# EAGLE board Jupiter Ace build026 (EAGLE 9.6.2), part 1 of 3
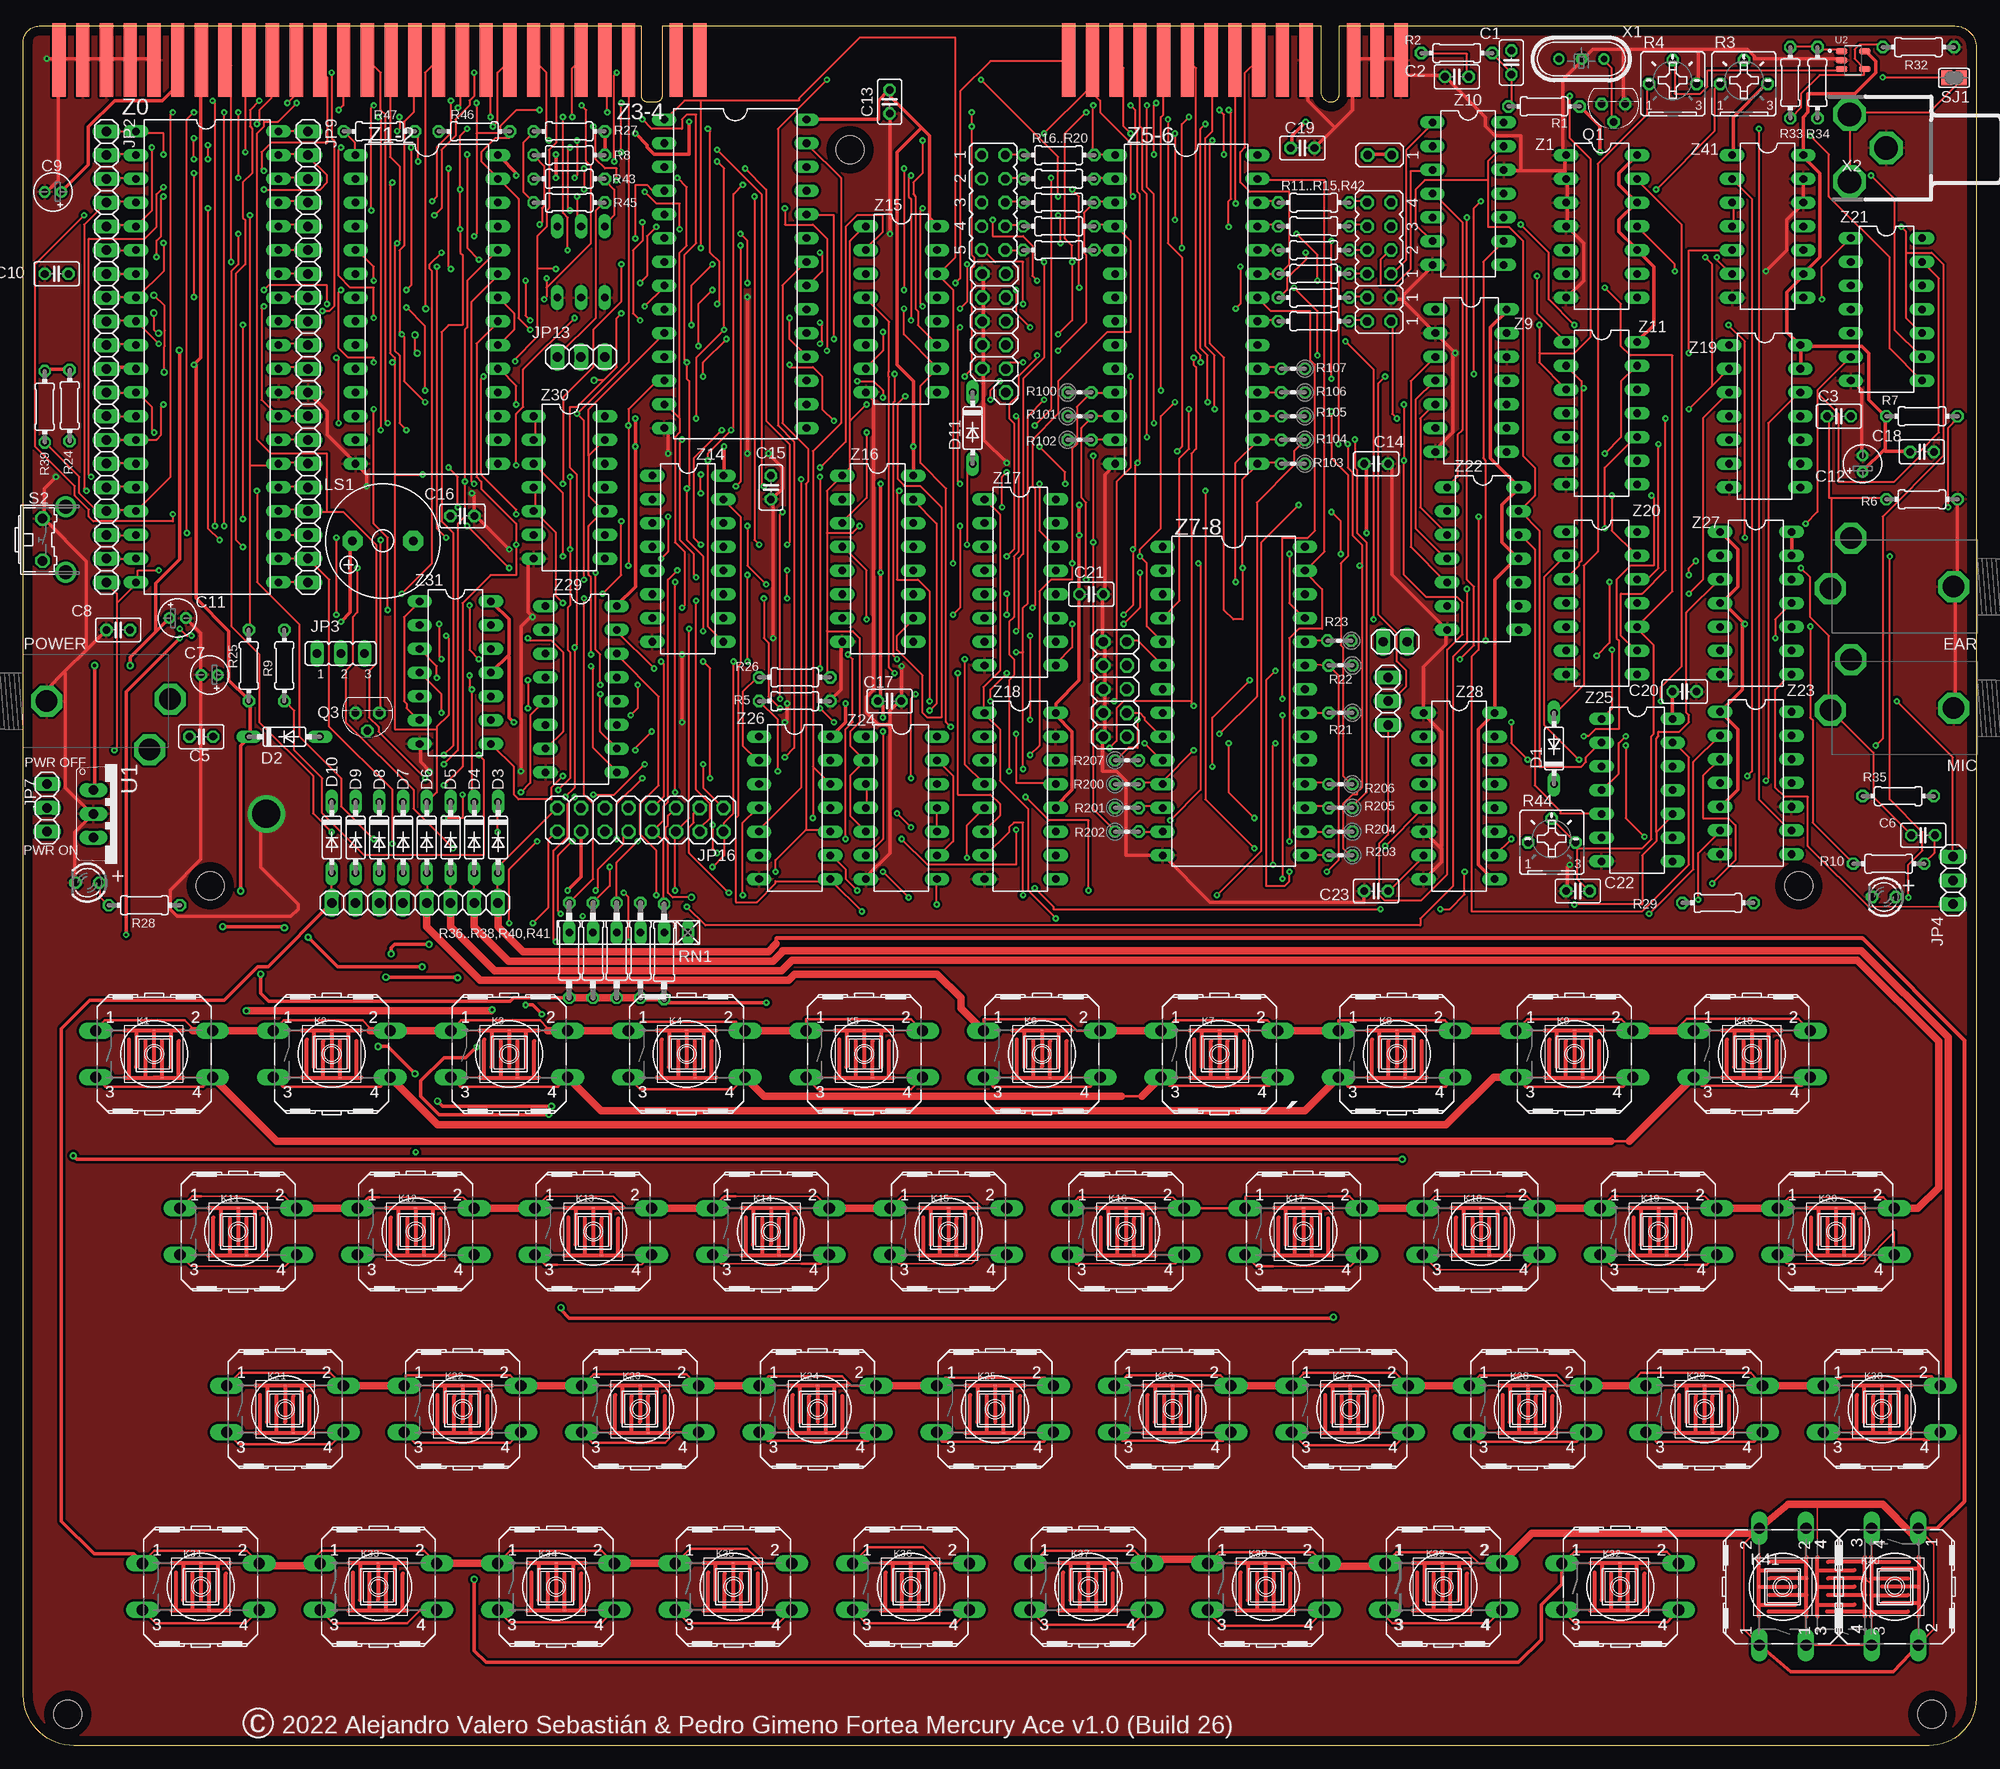
[diagram p5: board, top side]
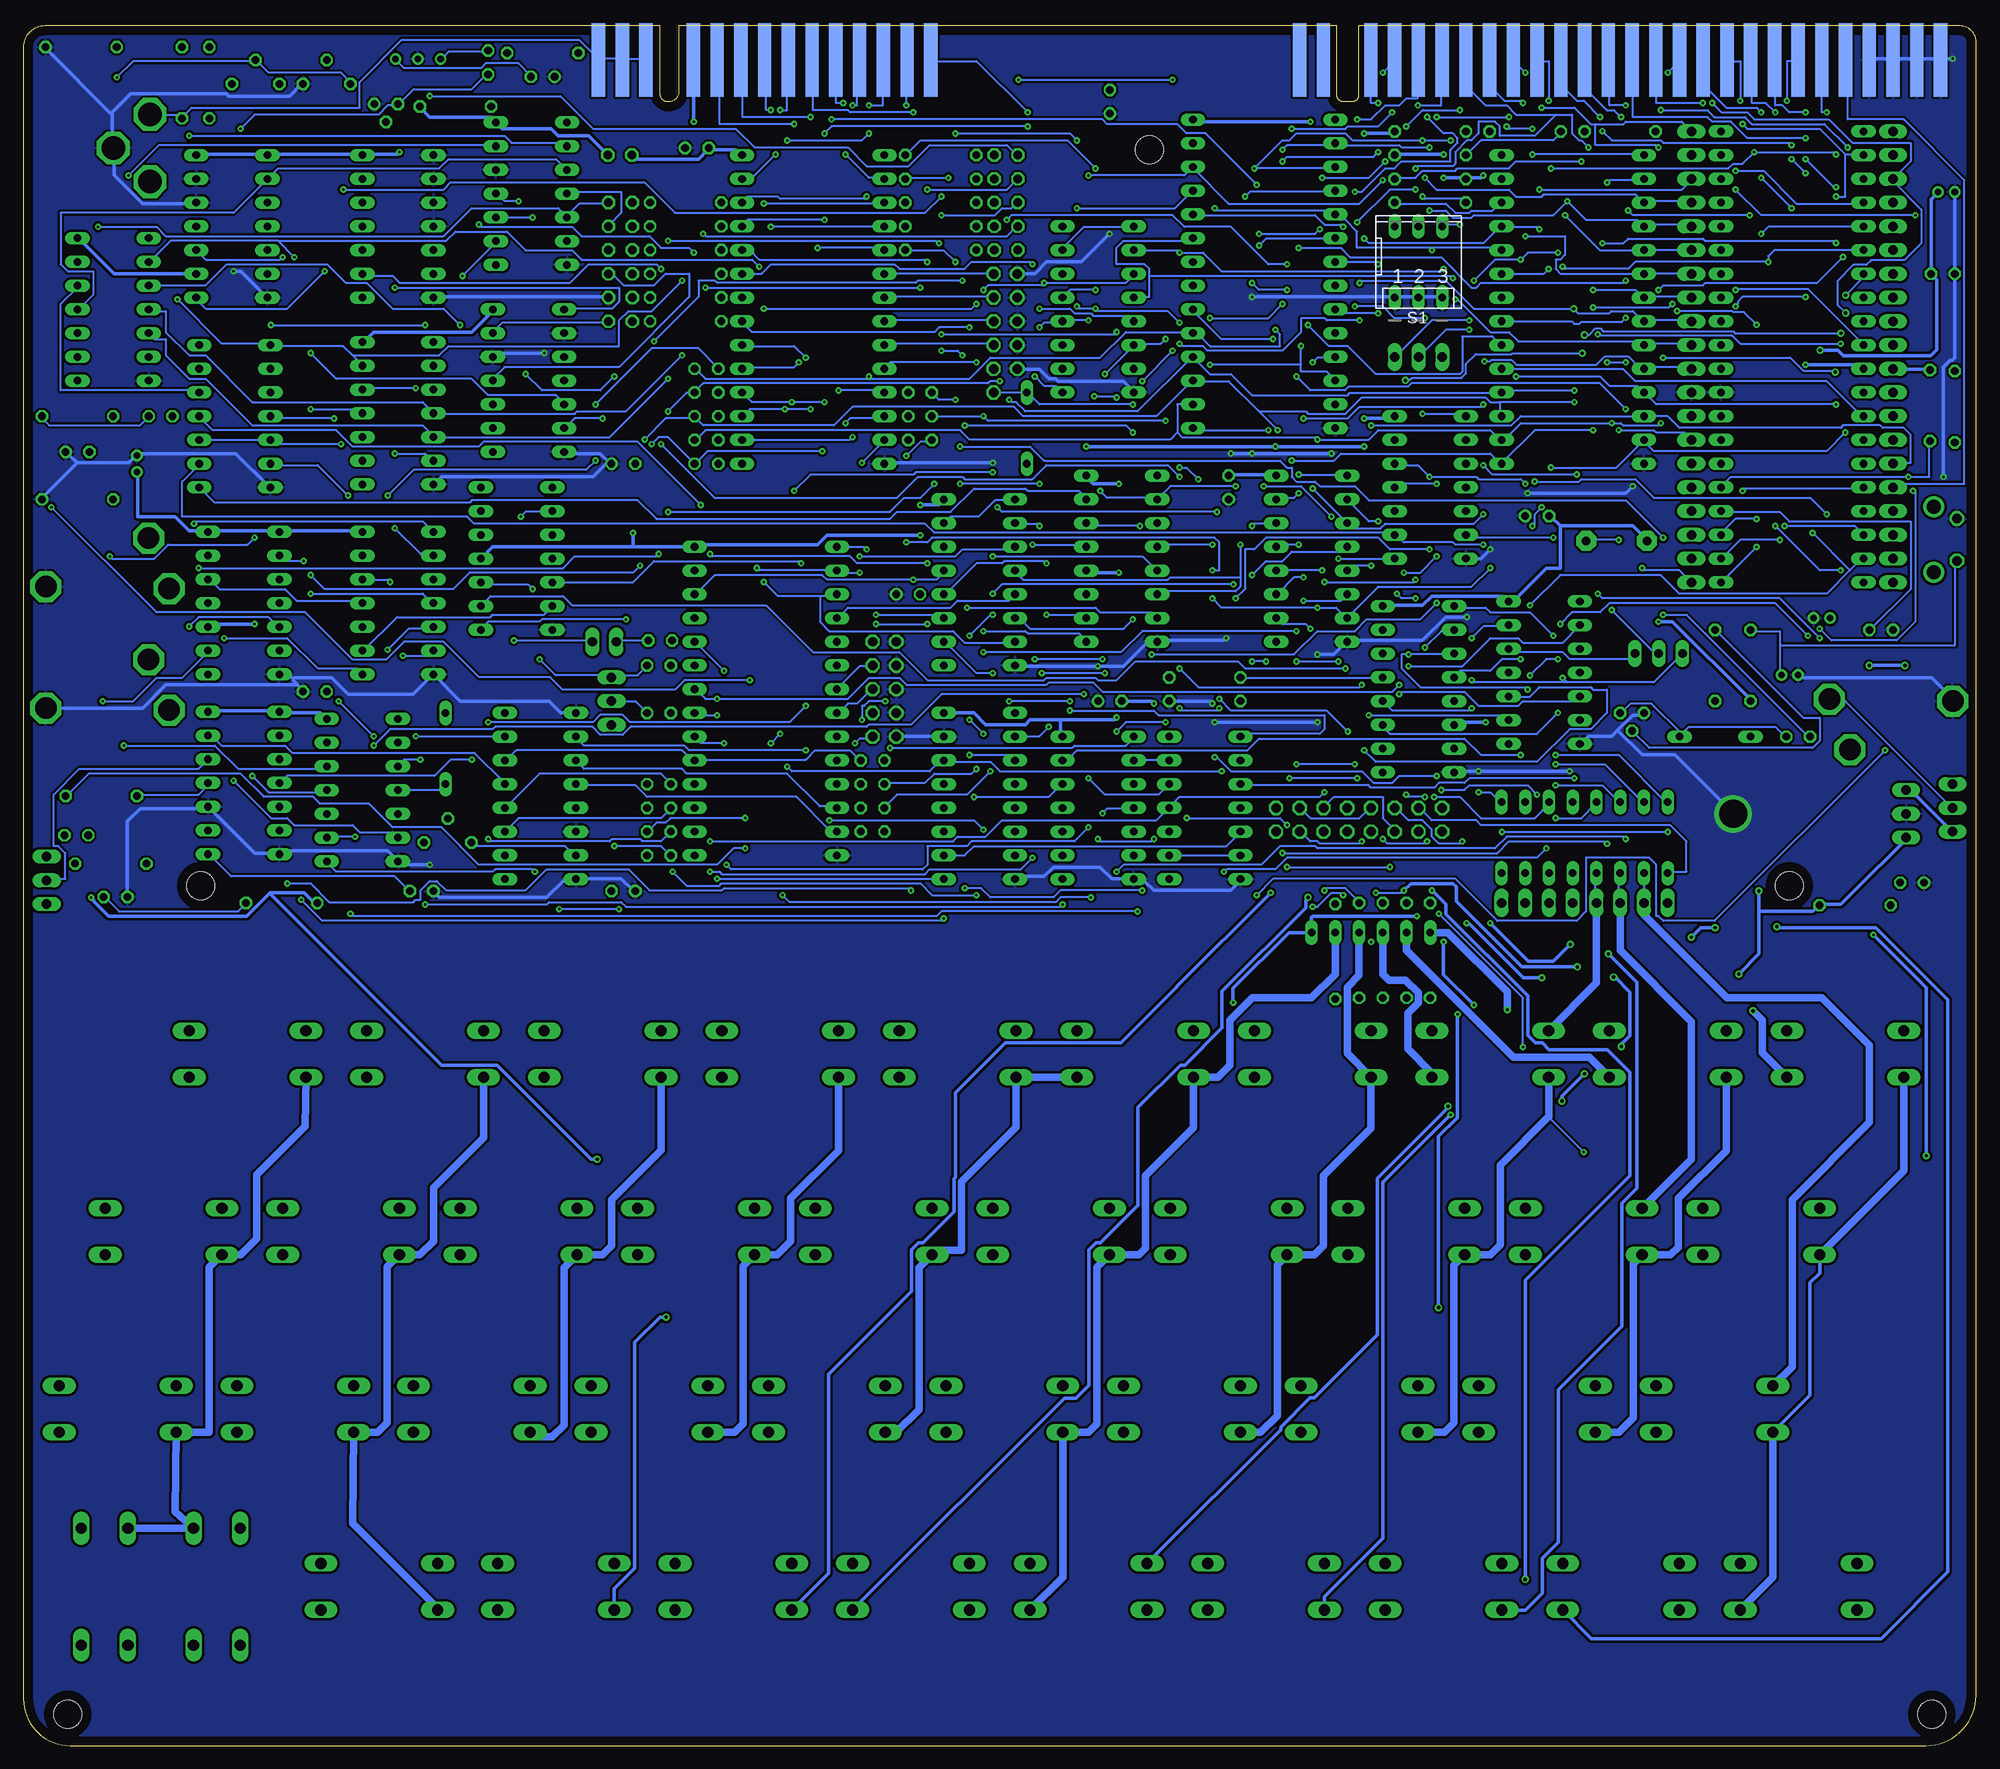
[diagram p6: board, bottom side, seen from below]

Size 209 x 184 mm. Coordinates in mm from the lower left corner, seen from the top.
Outline: 0,5.39 0,182.31 arc-90 1.69,184 66.1,184 66.1,176.56 arc90 66.77,175.9 67.77,175.9 arc90 68.4,176.53 68.4,184 138.86,184 138.86,176.98 arc90 139.96,175.87 arc90 140.86,176.77 140.86,184 206.72,184 arc-90 209,181.72 209,5.01 arc-90 203.99,0 5.39,0 arc-90 0,5.39
Copper layers (1*16): Top 0.035mm / dielectric 1.5mm / Bottom 0.035mm
Design rules "default *": minimum track width 6mil, minimum drill 10mil, track to track 8mil, track to pad 8mil, pad to pad 8mil, via to via 8mil, smd to smd 8mil, copper to edge 40mil, drill to drill 8mil, minimum pad ring 10mil, minimum via ring 8mil, stop-mask expansion 4mil, vias tented up to drill 0mil, thermal gap 10mil
Net classes: 0 default: width 0.2 mm; 1 power: width 0.4 mm
Holes 3 mm at 20,92 190,92 88.5,170.75 4.76,3.37 204.24,3.37
bKeepout: 1 lines
tRestrict: 1 lines
bRestrict: 1 lines
vRestrict: area 14,91.4 to 29.2,101.6

## Footprints (pad centres in the part's own frame; a part is rotated, then mirrored left to right if it is on the bottom)
EDGEPIN = smd 1.422 x 7.874: 1 0,0
C025-025X050 = drill 0.813 octagon: 1 -1.27,0; 2 1.27,0
E1,8-4 = drill 0.711 pad 1.168: + -0.889,0 | drill 0.711 pad 1.168 octagon: - 0.889,0
DO35-7 = drill 0.813 long: A 3.81,0; C -3.81,0
PJ302M = drill 2.3 pad 3.3 octagon: GND 2.5,0; SW 13.5,-5.2; TIP 15.7,0.2
1X08 = drill 1.016 long: 1 -8.89,0; 2 -6.35,0; 3 -3.81,0; 4 -1.27,0; 5 1.27,0; 6 3.81,0; 7 6.35,0; 8 8.89,0
1X20 = drill 1.016 long: 1 -24.13,0; 2 -21.59,0; 3 -19.05,0; 4 -16.51,0; 5 -13.97,0; 6 -11.43,0; 7 -8.89,0; 8 -6.35,0; 9 -3.81,0; 10 -1.27,0; 11 1.27,0; 12 3.81,0; 13 6.35,0; 14 8.89,0; 15 11.43,0; 16 13.97,0; 17 16.51,0; 18 19.05,0; 19 21.59,0; 20 24.13,0
JP2 = drill 0.914 long: 1 -2.54,0; 2 0,0; 3 2.54,0
1X03 = drill 1.016 long: 1 -2.54,0; 2 0,0; 3 2.54,0
JP1Q = drill 0.914 octagon: 1 -1.27,-1.27; 2 -1.27,1.27
JP4Q = drill 0.914 octagon: 1 -3.81,-1.27; 2 -3.81,1.27; 3 -1.27,-1.27; 4 -1.27,1.27; 5 1.27,-1.27; 6 1.27,1.27; 7 3.81,-1.27; 8 3.81,1.27
2X05 = drill 1.016 octagon: 1 -5.08,-1.27; 2 -5.08,1.27; 3 -2.54,-1.27; 4 -2.54,1.27; 5 0,-1.27; 6 0,1.27; 7 2.54,-1.27; 8 2.54,1.27; 9 5.08,-1.27; 10 5.08,1.27
1X01 = drill 1.016 octagon: 1 0,0
JP5Q = drill 0.914 octagon: 1 -5.08,-1.27; 2 -5.08,1.27; 3 -2.54,-1.27; 4 -2.54,1.27; 5 0,-1.27; 6 0,1.27; 7 2.54,-1.27; 8 2.54,1.27; 9 5.08,-1.27; 10 5.08,1.27
2X08 = drill 1.016 octagon: 1 -8.89,-1.27; 2 -8.89,1.27; 3 -6.35,-1.27; 4 -6.35,1.27; 5 -3.81,-1.27; 6 -3.81,1.27; 7 -1.27,-1.27; 8 -1.27,1.27; 9 1.27,-1.27; 10 1.27,1.27; 11 3.81,-1.27; 12 3.81,1.27; 13 6.35,-1.27; 14 6.35,1.27; 15 8.89,-1.27; 16 8.89,1.27
1X02 = drill 1.016 long: 1 -1.27,0; 2 1.27,0
B3F-40XXNOHOLE = drill 1.194 long: 1 -6.248,2.489; 2 6.248,2.489; 3 -6.248,-2.489; 4 6.248,-2.489
LED3MM = drill 0.813 octagon: A -1.27,0; K 1.27,0
F/QMX = drill 0.914 pad 2.159 octagon: + 3.251,0; - -3.251,0
TO92 = drill 0.813 octagon: 1 1.27,0; 2 0,1.905; 3 -1.27,0
0204/7 = drill 0.813 octagon: 1 -3.81,0; 2 3.81,0
B25P = drill 0.813 octagon: A -2.54,0; E 2.54,0; S 0,2.54
0204V = drill 0.813 octagon: 1 -1.27,0; 2 1.27,0
0207/10 = drill 0.813 octagon: 1 -5.08,0; 2 5.08,0
RN-6 = drill 0.813 long: 1 -6.35,0; 2 -3.81,0; 3 -1.27,0; 4 1.27,0; 5 3.81,0; 6 6.35,0
DP-03 = drill 0.813 long: 1 -2.54,-3.81; 2 0,-3.81; 3 2.54,-3.81; 4 2.54,3.81; 5 0,3.81; 6 -2.54,3.81
B3F-31XX = drill 1.016 octagon: 1 -2.261,-1.245; 2 2.261,-1.245 | drill 1.499 pad 2.159: 3 -3.505,1.245; 4 3.505,1.245
SJ = smd 1.168 x 1.6: 1 -0.762,0; 2 0.762,0
TO220V = drill 1.016 long: 1 -2.54,-2.54; 2 0,-2.54; 3 2.54,-2.54
SOT95P280X145-5N = smd 1.22 x 0.6: 1 -1.245,0.95; 2 -1.245,0; 3 -1.245,-0.95; 4 1.245,-0.95; 5 1.245,0.95
CARBONB3F = smd 0.305 x 0.152: P$1 0,2.54; P$2 0.889,-2.54
HC49U = drill 0.7 pad 1.2: 1 -2.413,0; 2 -0.027,0; 3 2.413,0
CON-CONRAD_736880-49 = drill 2.5 pad 3.302 octagon: 1 -0.11,0; 2 3.81,3.595; 2@2 3.81,-3.595
DIL40 = drill 0.813 long: 1 -24.13,-7.62; 2 -21.59,-7.62; 3 -19.05,-7.62; 4 -16.51,-7.62; 5 -13.97,-7.62; 6 -11.43,-7.62; 7 -8.89,-7.62; 8 -6.35,-7.62; 9 -3.81,-7.62; 10 -1.27,-7.62; 11 1.27,-7.62; 12 3.81,-7.62; 13 6.35,-7.62; 14 8.89,-7.62; 15 11.43,-7.62; 16 13.97,-7.62; 17 16.51,-7.62; 18 19.05,-7.62; 19 21.59,-7.62; 20 24.13,-7.62; 21 24.13,7.62; 22 21.59,7.62; 23 19.05,7.62; 24 16.51,7.62; 25 13.97,7.62; 26 11.43,7.62; 27 8.89,7.62; 28 6.35,7.62; 29 3.81,7.62; 30 1.27,7.62; 31 -1.27,7.62; 32 -3.81,7.62; 33 -6.35,7.62; 34 -8.89,7.62; 35 -11.43,7.62; 36 -13.97,7.62; 37 -16.51,7.62; 38 -19.05,7.62; 39 -21.59,7.62; 40 -24.13,7.62
DIL14 = drill 0.813 long: 1 -7.62,-3.81; 2 -5.08,-3.81; 3 -2.54,-3.81; 4 0,-3.81; 5 2.54,-3.81; 6 5.08,-3.81; 7 7.62,-3.81; 8 7.62,3.81; 9 5.08,3.81; 10 2.54,3.81; 11 0,3.81; 12 -2.54,3.81; 13 -5.08,3.81; 14 -7.62,3.81
DIL28-6 = drill 0.813 long: 1 -16.51,-7.62; 2 -13.97,-7.62; 3 -11.43,-7.62; 4 -8.89,-7.62; 5 -6.35,-7.62; 6 -3.81,-7.62; 7 -1.27,-7.62; 8 1.27,-7.62; 9 3.81,-7.62; 10 6.35,-7.62; 11 8.89,-7.62; 12 11.43,-7.62; 13 13.97,-7.62; 14 16.51,-7.62; 15 16.51,7.62; 16 13.97,7.62; 17 11.43,7.62; 18 8.89,7.62; 19 6.35,7.62; 20 3.81,7.62; 21 1.27,7.62; 22 -1.27,7.62; 23 -3.81,7.62; 24 -6.35,7.62; 25 -8.89,7.62; 26 -11.43,7.62; 27 -13.97,7.62; 28 -16.51,7.62
DIL16 = drill 0.813 long: 1 -8.89,-3.81; 2 -6.35,-3.81; 3 -3.81,-3.81; 4 -1.27,-3.81; 5 1.27,-3.81; 6 3.81,-3.81; 7 6.35,-3.81; 8 8.89,-3.81; 9 8.89,3.81; 10 6.35,3.81; 11 3.81,3.81; 12 1.27,3.81; 13 -1.27,3.81; 14 -3.81,3.81; 15 -6.35,3.81; 16 -8.89,3.81

## Placement (x,y rotation side)
1A  [EDGEPIN]  11.43,180.34 0 top
1A1  [EDGEPIN]  111.89,180.34 0 top
1B  [EDGEPIN]  11.43,180.34 0 bottom
1B1  [EDGEPIN]  111.89,180.34 0 bottom
2A  [EDGEPIN]  13.97,180.34 0 top
2A1  [EDGEPIN]  114.43,180.34 0 top
2B  [EDGEPIN]  13.97,180.34 0 bottom
2B1  [EDGEPIN]  114.43,180.34 0 bottom
3A  [EDGEPIN]  16.51,180.34 0 top
3A1  [EDGEPIN]  116.97,180.34 0 top
3B  [EDGEPIN]  16.51,180.34 0 bottom
3B1  [EDGEPIN]  116.97,180.34 0 bottom
4A  [EDGEPIN]  19.05,180.34 0 top
4A1  [EDGEPIN]  119.51,180.34 0 top
4B  [EDGEPIN]  19.05,180.34 0 bottom
4B2  [EDGEPIN]  119.51,180.34 0 bottom
5A  [EDGEPIN]  21.59,180.34 0 top
5A1  [EDGEPIN]  122.05,180.34 0 top
5B  [EDGEPIN]  21.59,180.34 0 bottom
5B2  [EDGEPIN]  122.05,180.34 0 bottom
6A  [EDGEPIN]  24.13,180.34 0 top
6A1  [EDGEPIN]  124.59,180.34 0 top
6B  [EDGEPIN]  24.13,180.34 0 bottom
6B2  [EDGEPIN]  124.59,180.34 0 bottom
7A  [EDGEPIN]  26.67,180.34 0 top
7A1  [EDGEPIN]  127.13,180.34 0 top
7B  [EDGEPIN]  26.67,180.34 0 bottom
7B2  [EDGEPIN]  127.13,180.34 0 bottom
8A  [EDGEPIN]  29.21,180.34 0 top
8A1  [EDGEPIN]  129.67,180.34 0 top
8B  [EDGEPIN]  29.21,180.34 0 bottom
8B2  [EDGEPIN]  129.67,180.34 0 bottom
9A  [EDGEPIN]  31.75,180.34 0 top
9A1  [EDGEPIN]  132.21,180.34 0 top
9B  [EDGEPIN]  31.75,180.34 0 bottom
9B1  [EDGEPIN]  132.21,180.34 0 bottom
10A  [EDGEPIN]  34.29,180.34 0 top
10A1  [EDGEPIN]  134.75,180.34 0 top
10B  [EDGEPIN]  34.29,180.34 0 bottom
10B1  [EDGEPIN]  134.75,180.34 0 bottom
11A  [EDGEPIN]  36.83,180.34 0 top
11A1  [EDGEPIN]  137.29,180.34 0 top
11B  [EDGEPIN]  36.83,180.34 0 bottom
11B1  [EDGEPIN]  137.29,180.34 0 bottom
12A  [EDGEPIN]  39.37,180.34 0 top
12B  [EDGEPIN]  39.37,180.34 0 bottom
13A  [EDGEPIN]  41.91,180.34 0 top
13A1  [EDGEPIN]  142.37,180.34 0 top
13B  [EDGEPIN]  41.91,180.34 0 bottom
13B1  [EDGEPIN]  142.37,180.34 0 bottom
14A  [EDGEPIN]  44.45,180.34 0 top
14A1  [EDGEPIN]  144.91,180.34 0 top
14B  [EDGEPIN]  44.45,180.34 0 bottom
14B1  [EDGEPIN]  144.91,180.34 0 bottom
15A  [EDGEPIN]  46.99,180.34 0 top
15A1  [EDGEPIN]  147.45,180.34 0 top
15B  [EDGEPIN]  46.99,180.34 0 bottom
15B1  [EDGEPIN]  147.45,180.34 0 bottom
16A  [EDGEPIN]  49.53,180.34 0 top
16B  [EDGEPIN]  49.53,180.34 0 bottom
17A  [EDGEPIN]  52.07,180.34 0 top
17B  [EDGEPIN]  52.07,180.34 0 bottom
18A  [EDGEPIN]  54.61,180.34 0 top
18B  [EDGEPIN]  54.61,180.34 0 bottom
19A  [EDGEPIN]  57.15,180.34 0 top
19B  [EDGEPIN]  57.15,180.34 0 bottom
20A  [EDGEPIN]  59.69,180.34 0 top
20B  [EDGEPIN]  59.69,180.34 0 bottom
21A  [EDGEPIN]  62.23,180.34 0 top
21B  [EDGEPIN]  62.23,180.34 0 bottom
22A  [EDGEPIN]  64.77,180.34 0 top
22B  [EDGEPIN]  64.77,180.34 0 bottom
24A  [EDGEPIN]  69.85,180.34 0 top
24B  [EDGEPIN]  69.85,180.34 0 bottom
25A  [EDGEPIN]  72.39,180.34 0 top
25B  [EDGEPIN]  72.39,180.34 0 bottom
26A  [EDGEPIN]  8.89,180.34 0 top
26B  [EDGEPIN]  8.89,180.34 0 bottom
27A  [EDGEPIN]  6.35,180.34 0 top
27B  [EDGEPIN]  6.35,180.34 0 bottom
28A  [EDGEPIN]  3.81,180.34 0 top
28B  [EDGEPIN]  3.81,180.34 0 bottom
C1  30pF  [C025-025X050]  159.26,180.09 270 top
C2  100pF  [C025-025X050]  153.42,178.56 180 top
C3  2.2uF  [C025-025X050]  194.31,142.24 0 top
C5  47pF  [C025-025X050]  19.05,107.95 0 top
C6  47nF  [C025-025X050]  203.33,97.41 0 top
C7  1uF  [E1,8-4]  19.94,114.55 180 top
C8  2.2nF  [C025-025X050]  10.16,119.38 180 top
C9  100uF  [E1,8-4]  3.17,166.24 180 top
C10  100nF  [C025-025X050]  3.56,157.48 180 top
C11  1uF  [E1,8-4]  16.51,120.65 0 top
C12  1uF  [E1,8-4]  196.85,137.16 90 top
C13  100nF  [C025-025X050]  92.71,175.9 90 top
C14  100nF  [C025-025X050]  144.78,137.16 180 top
C15  100nF  [C025-025X050]  80.01,134.62 90 top
C16  100nF  [C025-025X050]  46.99,131.57 180 top
C17  100nF  [C025-025X050]  92.71,111.76 180 top
C18  100nF  [C025-025X050]  203.2,138.43 180 top
C19  100nF  [C025-025X050]  136.91,170.94 180 top
C20  100nF  [C025-025X050]  177.8,112.78 180 top
C21  100nF  [C025-025X050]  114.3,123.19 180 top
C22  470pF  [C025-025X050]  166.37,91.44 0 top
C23  10pF  [C025-025X050]  144.78,91.44 0 top
D1  1N4148DO35-7  [DO35-7]  163.83,106.68 90 top
D2  1N4148DO35-7  [DO35-7]  27.94,107.95 0 top
D3  1N4148DO35-7  [DO35-7]  50.8,97.16 270 top
D4  1N4148DO35-7  [DO35-7]  48.26,97.16 270 top
D5  1N4148DO35-7  [DO35-7]  45.72,97.16 270 top
D6  1N4148DO35-7  [DO35-7]  43.18,97.16 270 top
D7  1N4148DO35-7  [DO35-7]  40.64,97.16 270 top
D8  1N4148DO35-7  [DO35-7]  38.1,97.16 270 top
D9  1N4148DO35-7  [DO35-7]  35.56,97.16 270 top
D10  1N4148DO35-7  [DO35-7]  33.02,97.16 270 top
D11  1N4148DO35-7  [DO35-7]  101.6,140.97 270 top
EAR  PJ302M  [PJ302M]  209.1,124 180 top
JP1  ROWS  [1X08]  41.91,90.17 0 top
JP2  [1X20]  8.89,148.59 270 top
JP3  MEMORY  [JP2]  33.97,116.84 0 top
JP4  VIDEO  [1X03]  206.5,92.58 270 top
JP5  [JP1Q]  145.1,153.67 90 top
JP6  ACE81_ENABLED  [JP1Q]  145.1,156.21 90 top
JP7  POWER  [1X03]  2.54,100.33 90 top
JP8  VCC  [JP1Q]  145.16,171.45 90 top
JP9  [1X20]  30.48,148.59 270 top
JP10  ACE81 RIGTH  [JP4Q]  145.1,161.29 90 top
JP11  BG PAGES  [2X05]  103.89,152.4 270 top
JP12  CHR_PAGES  [2X05]  116.84,113.03 270 top
JP13  ROMADDR  [1X03]  59.69,148.59 180 top
JP14  [1X01]  105.16,144.78 0 top
JP15  ACE81 LEFT  [JP5Q]  103.82,165.1 270 top
JP16  KEYBOARD  [2X08]  66.04,99.06 180 top
JP17  CNT11  [1X02]  146.81,118.11 0 top
JP18  INV,CNT9,CNT10  [1X03]  146.05,111.76 270 top
K1  1  [B3F-40XXNOHOLE]  14,74 0 top
K2  2  [B3F-40XXNOHOLE]  33,74 0 top
K3  3  [B3F-40XXNOHOLE]  52,74 0 top
K4  4  [B3F-40XXNOHOLE]  71,74 0 top
K5  5  [B3F-40XXNOHOLE]  90,74 0 top
K6  6  [B3F-40XXNOHOLE]  109,74 0 top
K7  7  [B3F-40XXNOHOLE]  128,74 0 top
K8  8  [B3F-40XXNOHOLE]  147,74 0 top
K9  9  [B3F-40XXNOHOLE]  166,74 0 top
K10  0  [B3F-40XXNOHOLE]  185,74 0 top
K11  Q  [B3F-40XXNOHOLE]  23,55 0 top
K12  W  [B3F-40XXNOHOLE]  42,55 0 top
K13  E  [B3F-40XXNOHOLE]  61,55 0 top
K14  R  [B3F-40XXNOHOLE]  80,55 0 top
K15  T  [B3F-40XXNOHOLE]  99,55 0 top
K16  Y  [B3F-40XXNOHOLE]  118,55 0 top
K17  U  [B3F-40XXNOHOLE]  137,55 0 top
K18  I  [B3F-40XXNOHOLE]  156,55 0 top
K19  O  [B3F-40XXNOHOLE]  175,55 0 top
K20  P  [B3F-40XXNOHOLE]  194,55 0 top
K21  A  [B3F-40XXNOHOLE]  28,36 0 top
K22  S  [B3F-40XXNOHOLE]  47,36 0 top
K23  D  [B3F-40XXNOHOLE]  66,36 0 top
K24  F  [B3F-40XXNOHOLE]  85,36 0 top
K25  G  [B3F-40XXNOHOLE]  104,36 0 top
K26  H  [B3F-40XXNOHOLE]  123,36 0 top
K27  J  [B3F-40XXNOHOLE]  142,36 0 top
K28  K  [B3F-40XXNOHOLE]  161,36 0 top
K29  L  [B3F-40XXNOHOLE]  179.9,36 0 top
K30  ENTER  [B3F-40XXNOHOLE]  198.9,36 0 top
K31  SHIFT  [B3F-40XXNOHOLE]  19,17 0 top
K32  SYMBOL  [B3F-40XXNOHOLE]  170.9,17 0 top
K33  Z  [B3F-40XXNOHOLE]  38,17 0 top
K34  X  [B3F-40XXNOHOLE]  57,17 0 top
K35  C  [B3F-40XXNOHOLE]  76,17 0 top
K36  V  [B3F-40XXNOHOLE]  95,17 0 top
K37  B  [B3F-40XXNOHOLE]  114,17 0 top
K38  N  [B3F-40XXNOHOLE]  133,17 0 top
K39  M  [B3F-40XXNOHOLE]  152,17 0 top
K40  SPACE  [B3F-40XXNOHOLE]  200.3,17 270 top
K41  SPACE  [B3F-40XXNOHOLE]  188.3,17 90 top
LED1  POWER  [LED3MM]  6.86,92.33 180 top
LED2  ACE81  [LED3MM]  199.14,90.81 180 top
LS1  F/QMX  [F/QMX]  38.48,128.91 180 top
MIC  PJ302M  [PJ302M]  209.1,111 180 top
POWER  PJ302M  [PJ302M]  0,111.76 0 top
Q1  2N3904  [TO92]  170.18,175.64 180 top
Q3  BC337  [TO92]  36.83,110.49 180 top
R1  1K  [0204/7]  162.75,175.39 180 top
R2  47K  [0204/7]  153.42,181.1 0 top
R3  500R  [B25P]  184.15,177.8 0 top
R4  1K  [B25P]  176.53,177.8 0 top
R5  12K  [0204/7]  82.55,111.76 180 top
R6  1K  [0204/7]  203.2,133.35 180 top
R7  33K  [0204/7]  203.2,142.24 180 top
R8  10K  [0204/7]  58.42,170.18 180 top
R9  22K  [0204/7]  27.94,115.57 270 top
R10  10K  [0204/7]  199.64,94.36 180 top
R11  1K  [0204/7]  138.11,152.4 180 top
R12  1K  [0204/7]  138.11,157.48 180 top
R13  1K  [0204/7]  138.11,160.02 180 top
R14  1K  [0204/7]  138.11,162.56 180 top
R15  1K  [0204/7]  138.11,165.1 180 top
R16  1K  [0204/7]  110.81,170.18 0 top
R17  1K  [0204/7]  110.81,167.64 0 top
R18  1K  [0204/7]  110.81,165.1 0 top
R19  1K  [0204/7]  110.81,162.56 0 top
R20  1K  [0204/7]  110.81,160.02 0 top
R21  1K  [0204V]  140.97,110.49 180 top
R22  1K  [0204V]  140.97,115.57 180 top
R23  1K  [0204V]  140.84,118.24 180 top
R24  10K  [0204/7]  4.95,143.38 90 top
R25  10K  [0204/7]  24.13,115.57 270 top
R26  330  [0204/7]  82.55,114.3 0 top
R27  10K  [0204/7]  58.42,172.72 180 top
R28  680  [0204/7]  12.95,89.92 180 top
R29  680  [0204/7]  181.36,90.17 180 top
R32  200  [0204/7]  202.82,181.74 180 top
R33  200  [0204/7]  189.1,177.93 270 top
R34  75  [0204/7]  192.02,177.93 90 top
R35  300  [0204/7]  200.66,101.6 180 top
R36  4K7  [0207/10]  58.42,85.09 270 top
R37  4K7  [0207/10]  60.96,85.09 270 top
R38  4K7  [0207/10]  63.5,85.09 270 top
R39  10K  [0204/7]  2.29,143.26 90 top
R40  4K7  [0207/10]  66.04,85.09 270 top
R41  4K7  [0207/10]  68.58,84.96 270 top
R42  1K  [0204/7]  138.11,154.94 180 top
R43  10K  [0204/7]  58.42,167.64 0 top
R44  1K  [B25P]  163.58,96.65 0 top
R45  470R  [0204/7]  58.42,165.1 0 top
R46  470R  [0204/7]  48.26,172.72 0 top
R47  470R  [0204/7]  38.1,172.72 180 top
R100  1K  [0204V]  113.03,144.78 0 top
R101  1K  [0204V]  113.03,142.24 0 top
R102  1K  [0204V]  113.03,139.7 0 top
R103  1K  [0204V]  135.89,137.16 180 top
R104  1K  [0204V]  135.89,139.7 180 top
R105  1K  [0204V]  135.89,142.24 180 top
R106  1K  [0204V]  135.89,144.78 180 top
R107  1K  [0204V]  135.89,147.32 180 top
R200  1K  [0204V]  118.11,102.87 0 top
R201  1K  [0204V]  118.11,100.33 0 top
R202  1K  [0204V]  118.11,97.79 0 top
R203  1K  [0204V]  140.97,95.25 180 top
R204  1K  [0204V]  140.97,97.79 180 top
R205  1K  [0204V]  140.97,100.33 180 top
R206  1K  [0204V]  140.97,102.87 180 top
R207  1K  [0204V]  118.11,105.41 0 top
RN1  4K7  [RN-6]  64.77,87 180 top
S1  ROMSEL  [DP-03]  59.69,158.75 0 bottom
S2  RESET  [B3F-31XX]  3.3,129.03 270 top
SJ1  NO OPAMP  [SJ]  206.63,178.44 180 top
U1  7805  [TO220V]  10.03,99.69 270 top
U2  MAX4390EUK  [SOT95P280X145-5N]  195.83,180.34 0 top
U$1  40-XX-CARBON  [CARBONB3F]  13.97,74 0 top
U$2  40-XX-CARBON  [CARBONB3F]  33,74 0 top
U$3  40-XX-CARBON  [CARBONB3F]  52,74 0 top
U$4  40-XX-CARBON  [CARBONB3F]  71,74 0 top
U$5  40-XX-CARBON  [CARBONB3F]  90,74 0 top
U$6  40-XX-CARBON  [CARBONB3F]  109,74 0 top
U$7  40-XX-CARBON  [CARBONB3F]  128,74 0 top
U$8  40-XX-CARBON  [CARBONB3F]  147,74 0 top
U$9  40-XX-CARBON  [CARBONB3F]  166,74 0 top
U$10  40-XX-CARBON  [CARBONB3F]  185,74 0 top
U$11  40-XX-CARBON  [CARBONB3F]  23,55 0 top
U$12  40-XX-CARBON  [CARBONB3F]  42,55 0 top
U$13  40-XX-CARBON  [CARBONB3F]  61,55 0 top
U$14  40-XX-CARBON  [CARBONB3F]  80,55 0 top
U$15  40-XX-CARBON  [CARBONB3F]  99,55 0 top
U$16  40-XX-CARBON  [CARBONB3F]  118,55 0 top
U$17  40-XX-CARBON  [CARBONB3F]  137,55 0 top
U$18  40-XX-CARBON  [CARBONB3F]  156,55 0 top
U$19  40-XX-CARBON  [CARBONB3F]  175.01,54.99 0 top
U$20  40-XX-CARBON  [CARBONB3F]  194,55 0 top
U$21  40-XX-CARBON  [CARBONB3F]  28,36 0 top
U$22  40-XX-CARBON  [CARBONB3F]  47,36 0 top
U$23  40-XX-CARBON  [CARBONB3F]  66,36 0 top
U$24  40-XX-CARBON  [CARBONB3F]  85,36 0 top
U$25  40-XX-CARBON  [CARBONB3F]  104,36 0 top
U$26  40-XX-CARBON  [CARBONB3F]  123,36 0 top
U$27  40-XX-CARBON  [CARBONB3F]  142,36 0 top
U$28  40-XX-CARBON  [CARBONB3F]  161,36 0 top
U$29  40-XX-CARBON  [CARBONB3F]  179.9,36 0 top
U$30  40-XX-CARBON  [CARBONB3F]  198.9,36 0 top
U$31  40-XX-CARBON  [CARBONB3F]  19,17 0 top
U$32  40-XX-CARBON  [CARBONB3F]  170.84,17 0 top
U$33  40-XX-CARBON  [CARBONB3F]  37.95,17 0 top
U$34  40-XX-CARBON  [CARBONB3F]  57.04,17 0 top
U$35  40-XX-CARBON  [CARBONB3F]  75.95,17 0 top
U$36  40-XX-CARBON  [CARBONB3F]  94.95,17 0 top
U$37  40-XX-CARBON  [CARBONB3F]  113.95,17 0 top
U$38  40-XX-CARBON  [CARBONB3F]  132.95,17 0 top
U$39  40-XX-CARBON  [CARBONB3F]  151.85,17 0 top
U$40  40-XX-CARBON  [CARBONB3F]  188.3,17 90 top
U$41  40-XX-CARBON  [CARBONB3F]  194.56,17 90 top
U$42  40-XX-CARBON  [CARBONB3F]  200.3,17 270 top
X1  6.5MHz  [HC49U]  166.75,180.47 180 top
X2  CON-CONRAD_736880-49  [CON-CONRAD_736880-49]  199.26,170.94 180 top
Z0  Z80  [DIL40]  19.68,148.59 270 top
Z1  74LS74N  [DIL14]  168.91,162.56 270 top
Z1-2  27C512  [DIL28-6]  43.18,153.67 270 top
Z3-4  CY62256LL-PC  [DIL28-6]  76.2,157.48 270 top
Z5-6  CY62256LL-PC  [DIL28-6]  124.46,153.67 270 top
Z7-8  CY62256LL-PC  [DIL28-6]  129.54,111.76 270 top
Z9  74LS393N  [DIL14]  154.94,146.05 270 top
Z10  74LS393N  [DIL14]  154.62,166.05 270 top
Z11  74LS393N  [DIL14]  168.91,142.56 270 top
Z14  74367N  [DIL16]  71.12,127 270 top
Z15  74367N  [DIL16]  93.98,153.67 270 top
Z16  74367N  [DIL16]  91.44,127 270 top
Z17  74367N  [DIL16]  106.68,124.46 270 top
Z18  74367N  [DIL16]  106.68,101.6 270 top
Z19  74LS00N  [DIL14]  186.37,142.24 270 top
Z20  74LS08N  [DIL14]  168.91,122.24 270 top
Z21  74LS11N  [DIL14]  199.39,153.67 270 top
Z22  74LS11N  [DIL14]  156.21,127 270 top
Z23  74LS86N  [DIL14]  185.42,103 270 top
Z24  74LS02N  [DIL14]  93.98,100.33 270 top
Z25  74LS02N  [DIL14]  172.72,102.23 270 top
Z26  74LS32N  [DIL14]  82.55,100.33 270 top
Z27  74LS74N  [DIL14]  185.42,122.24 270 top
Z28  74LS166N  [DIL16]  153.67,101.6 270 top
Z29  74LS138N  [DIL16]  59.69,113.03 270 top
Z30  74LS00N  [DIL14]  58.42,134.62 270 top
Z31  74LS11N  [DIL14]  46.23,114.81 270 top
Z41  74LS00N  [DIL14]  186.69,162.56 270 top

## Tracks (layer width: path | path; a pad name or v marks a point on that pad's centre or on a via)
9V  (via drill 0.35)
  Top 0.4: C11.+ 14.16,119.19 | 14.16,119.19 11.43,116.46 v11.43,115.57 | v7.62,115.57 7.62,102.36 U1.1 | C9.+ 6.96,169.14 6.96,173.2 9.76,176 14.85,176 16.51,177.66 3A.1 | 14.16,119.19 14.16,124.37 16.73,126.95 16.73,149.29 v16.7,149.29
  Bottom 0.4: JP7.1 6.99,102.23 U1.1 | v11.43,115.57 v7.62,115.57 | v16.7,149.29 14.83,149.29 14.23,148.69 4.85,148.69 4.19,149.35 4.19,156.84 C10.1 4.83,165.48 C9.+
/BUSAK  (via drill 0.25)
  Top 0.2: Z0.23 27.5,129.5 30.25,129.5 JP9.18 | v23.5,152.02 v23.5,131.25 | v32,153.5 32.75,153.5 33.25,154 33.25,171.75 33,172 v33,179
  Bottom 0.2: v23.5,131.25 25.75,131.25 27.25,129.75 Z0.23 | v33,179 31.75,180.25 9B.1 | v32,153.5 26.15,153.5 26.01,153.37 24.85,153.37 v23.5,152.02
/BUSRQ  (via drill 0.25)
  Top 0.2: JP9.16 30.25,134.75 27.5,134.75 Z0.25 | v18.25,169.75 v18.25,172 | v15,166.75 14.25,166 14.25,162.5 13,161.25 7,161.25 7,136 v7.25,135.75
  Bottom 0.2: R24.1 5,139.5 5,135.75 v7.25,135.75 26.25,135.75 27.25,134.75 Z0.25 | v18.25,172 24.5,172 26.25,173.75 28.25,173.75 28.75,174.25 36.75,174.25 36.75,180.25 11B.1 | v18.25,169.75 15.25,166.75 v15,166.75
/HALT  (via drill 0.25)
  Top 0.2: Z0.18 12,129.5 9,129.5 JP2.18 | v20.5,130.5 20.5,175.75 v20.25,176
  Bottom 0.2: v20.5,130.5 13,130.5 12.25,129.75 Z0.18 | v20.25,176 20.25,180.25 19.25,180.25 4B.1
/INT  (via drill 0.25)
  Top 0.2: Z0.16 12,134.75 9,134.75 JP2.16 | v136.5,132.75 132.5,128.75 132.5,95.75 v127.75,91 | v92,93.5 v94.75,90.75 | v37.5,97 34,100.5 34,103.5 29.5,108 29.5,120 25,124.5 v25,134.25
  Bottom 0.2: v136.5,132.75 143.25,139.5 159.75,139.5 160.25,139 173.75,139 175.5,140.75 188.75,140.75 190,142 Z19.11 | v127.75,91 127,90.25 98.5,90.25 98,90.75 v94.75,90.75 | v92,93.5 91.25,94.25 76.5,94.25 74.5,96.25 70.75,96.25 70.5,96 51.5,96 50.25,97.25 37.75,97.25 v37.5,97 | v25,134.25 24.75,134.5 12.25,134.5 Z0.16 | 2B.1 13.75,180.25 13.75,174 7.75,174 1.25,167.5 1.25,135 8.5,135 8.75,134.75 JP2.16
/IORQ  (via drill 0.25)
  Top 0.2: v77,91 77,98.75 78.5,100.25 Z26.4 | v9.75,106.5 10,106.75 10,122.25 | 10,122.25 10,123.25 9,124.25 JP2.20 | 10,122.25 12,124.25 Z0.20 12.25,124.5 12.25,125.75 v14.5,125.75 | v21.5,130.5 v21.5,174.75
  Bottom 0.2: v77,91 75.24,92.76 55.76,92.76 51.25,88.25 42.75,88.25 41.75,89.25 41.75,95 35,95 34.25,94.25 34.25,88.75 34,88.75 33.5,88.25 28,88.25 v9.75,106.5 | v21.5,174.75 22.5,175.75 24,175.75 24,180.25 6B.1 | v21.5,130.5 16.75,125.75 v14.5,125.75
/M1  (via drill 0.25)
  Top 0.2: Z0.27 27.5,139.75 30.25,139.75 JP9.14 | v38.25,140.75 38.25,174 v38,174.25
  Bottom 0.2: v38.25,140.75 34.5,140.75 34.25,140.5 31.25,140.5 30.5,139.75 JP9.14 | v38,174.25 38.75,175 39.5,175 41.75,177.25 41.75,180.25 13B.1
/MREQ  (via drill 0.25)
  Top 0.2: JP2.19 Z0.19 | v48.75,116.25 47.75,117.25 v47.75,122 | v18.25,174.75 17.5,174 v17.5,129.75
  Bottom 0.2: v48.75,116.25 50.75,116.25 52,115 55.25,115 55.75,114.5 Z29.4 | v47.75,122 44.5,125.25 33.75,125.25 31.75,123.25 16,123.25 13.5,125.75 | 13.5,125.75 12.25,127 Z0.19 | v18.25,174.75 20,174.75 20.75,175.5 21.5,175.5 21.5,180.25 5B.1 | 13.5,125.75 v17.5,129.75
/NMI  (via drill 0.25)
  Top 0.2: R39.1 2.5,139.25 6,135.75 6,134 7.75,132.25 8.75,132.25 JP2.17 9,132.25 12,132.25 Z0.17 12.25,132.25 15.75,135.75 15.75,174.5 v16,174.75
  Bottom 0.2: v16,174.75 16.5,174.75 16.5,180.25 3B.1
/RD  (via drill 0.25)
  Top 0.2: 83.75,98 86.25,98 Z26.10 | 83.75,98 83.75,135 84,135.25 84,138.75 81.25,141.5 81.25,156.25 83.75,158.75 Z3-4.22 | Z0.21 27.5,124.5 30.25,124.5 JP9.20 | v23.5,128.25 22.75,129 22.75,157.5 23.75,158.5 23.75,163.25 23.5,163.5 23.5,167.25 24.5,168.25 24.5,173 24.25,173.25 24.25,175 v25.25,176 | 83.75,98 80.5,94.75 v80.5,93.5 | v46,96 41.75,100.25 41.75,102.25 34.5,109.5 34.5,115 35.25,115.75 35.25,120.75 35.75,121.25 v35.75,126
  Bottom 0.2: v23.5,128.25 27.25,124.5 Z0.21 | v25.25,176 25.25,180.25 26.5,180.25 7B.1 | v80.5,93.5 80.25,93.75 75,93.75 73.75,95 47,95 v46,96 | v35.75,126 35.5,125.75 31.75,125.75 30.5,124.5 JP9.20
/RFSH  (via drill 0.25)
  Top 0.2: JP9.13 30.25,142.25 27.5,142.25 Z0.28 27.25,142.25 25.5,144 25.5,153.75 v25.75,154 | v18.25,168.25 v18.25,155 | v19.75,171.25 v19.75,169.75 | v40,172.75 40.25,173 v40.25,174.25
  Bottom 0.2: v25.75,154 25.5,154.25 25.5,154.51 25,155 v18.25,155 | v19.75,169.75 v18.25,168.25 | v19.75,171.25 20,171.5 33.5,171.5 33.75,171.75 39,171.75 v40,172.75 | v40.25,174.25 42,176 42.75,176 44.25,177.5 44.25,180.25 14B.1
/VHOLD  (via drill 0.25)
  Top 0.2: v97,110.75 97.75,111.5 97.75,130.75 95.25,133.25 Z16.15
  Bottom 0.2: v97,110.75 88,110.75 87.5,110.25 69.75,110.25 69.75,108.75 70.25,108.25 78.25,108.25 78.5,108 Z26.1 | Z19.8 190,134.5 188.5,133 161.25,133 161,133.25 143.25,133.25 141.25,131.25 116.25,131.25 115.5,132 109.75,132 107.25,134.5 101.75,134.5 101.5,134.25 96,134.25 95.25,133.5 Z16.15
/WAIT  (via drill 0.25)
  Top 0.2: v43,103.5 38,108.5 38,109 37,110 37,115 37.75,115.75 37.75,128.5 34.25,132 32.5,132 | 32.5,132 30.5,132 JP9.17 30.25,132.25 27.5,132.25 Z0.24 | v29.25,175.75 27.25,173.75 25.75,173.75 25.75,173.25 25,172.5 25,139.75 26.5,138.25 32.5,138.25 32.5,132
  Bottom 0.2: C8.1 11.25,119.5 7,123.75 7,131 20,131 21,132 27.25,132 Z0.24 | v43,103.5 54.25,103.5 54.75,103 57.5,103 58,102.5 64.75,102.5 65,102.75 78.5,102.75 Z26.3 | v29.25,175.75 34.25,175.75 34.25,180.25 10B.1
/WE1  (via drill 0.25)
  Top 0.2: Z30.2 54.75,139.75 54.75,142 Z30.1 | 22A.1 64.75,180.25 64.75,148 v59.25,142.5 60,141.75 v60,124.75 | v135.5,96.75 135.5,118.5 136.5,119.5 139,119.5 139,123.75 137.25,125.5 Z7-8.27 137.25,125.75 139.25,127.75 139.25,167.5 132.25,167.5 Z5-6.27 | v128,175 128.5,174.5 v128.5,170.25 | v69.75,102 v69.75,124.5
  Bottom 0.2: v59.25,142.5 55,142.5 54.75,142.25 Z30.1 | v135.5,96.75 109.5,96.75 109,97.25 106,97.25 104.25,99 87.75,99 86.5,100.25 Z26.11 86.25,100.5 85.25,101.5 70.25,101.5 v69.75,102 | v128,175 127.25,175 127.25,180.25 7B2.1 | v128.5,170.25 131,167.75 132,167.75 Z5-6.27 | v60,124.75 60.25,124.5 v69.75,124.5
/WR  (via drill 0.25)
  Top 0.2: Z0.22 JP9.19 30.5,127 32.75,124.75 32.75,109 39.5,102.25 v39.5,96.5 | v21,129 19.75,130.25 v19.75,164.5 | v23,174.75 v23,167.75 | 84.5,104.75 86.25,103 Z26.12 | 84.5,104.75 84.5,138.5 87.5,141.5 87.5,167.75 84,171.25 Z3-4.27 | v173.5,97.25 171.5,99.25 v171.5,107 | v95.5,112.5 95,112 v95,103.5 | v74.25,95.5 73.75,96 v73.75,98.5 | 84.5,104.75 v84.5,99.25
  Bottom 0.2: v21,129 25.25,129 27.25,127 Z0.22 | v23,167.75 v19.75,164.5 | v23,174.75 23.5,175.25 26.75,175.25 29,177.5 29,180.25 8B.1 | v173.5,97.25 176.5,97.25 Z25.9 | v171.5,107 169.75,108.75 158.75,108.75 158.5,109 148.1,109 147.25,108.16 144.85,108.16 144,109 118.75,109 118.5,109.25 114,109.25 110.75,112.5 v95.5,112.5 | v95,103.5 93.25,101.75 87.5,101.75 86.5,102.75 Z26.12 | v39.5,96.5 39.75,96.75 50,96.75 51.25,95.5 v74.25,95.5 | v73.75,98.5 74.5,99.25 v84.5,99.25
A0  (via drill 0.25)
  Top 0.2: Z0.30 27.5,147.5 30.25,147.5 JP9.11 | v85.25,159.75 85.5,159.5 85.5,157.75 84,156.25 Z3-4.21 | v83.25,135.5 83.25,102.5 78.75,98 Z26.5 | v85.25,136.75 88,139.5 88,162.5 89.25,163.75 92,163.75 92,162 90.25,160.25 Z15.2 | v52.63,148.12 52.5,148.24 55,150.74 55,158 | 55,158 55,161.5 56,162.5 56,164.25 56.25,164.5 56.25,170.75 57,171.5 57,180.25 19A.1 | v57,158 55,158
  Bottom 0.2: Z18.10 108.25,95.25 107.25,96.25 80.25,96.25 78.75,97.75 Z26.5 | JP9.11 30.5,147.5 35.5,147.5 Z1-2.10 35.62,147.38 35.99,147.38 37.24,148.63 39.76,148.63 40.64,147.76 49.22,147.76 49.74,148.28 51.86,148.28 52.03,148.12 v52.63,148.12 | Z15.2 90,160 85.5,160 v85.25,159.75 82.75,159.75 80.75,157.75 57.25,157.75 v57,158 | v83.25,135.5 84.5,136.75 v85.25,136.75
A1  (via drill 0.25)
  Top 0.2: Z0.31 27.5,150 30.25,150 JP9.10 | v100,114.75 100,101.75 103.5,101.75 104.5,100.75 104.5,99.5 103,98 Z18.6 | Z15.4 90.25,154.75 92.66,152.34 92.66,147.05 92.62,147.01 92.62,146.49 92.66,146.45 92.66,115.34 v93.25,114.75 | v55.75,154.75 56,155 56,156 | v56,157 56,156 | v59.75,175.5 60.25,175 60.25,169.5 60.75,169 60.75,160.75 56,156
  Bottom 0.2: JP9.10 30.5,150 35.5,150 Z1-2.9 35.75,150 36,150.25 49,150.25 50,151.25 52,151.25 55.5,154.75 v55.75,154.75 | v93.25,114.75 v100,114.75 | 88.5,157.25 88.5,155 90,155 Z15.4 | 88.5,157.25 88.5,158 89,158.5 92,158.5 92,160.25 91.25,161 84.25,161 84,161.25 Z3-4.23 | v56,157 56.25,157.25 88.5,157.25 | v59.75,175.5 57.25,175.5 57.25,180.25 19B.1
A2  (via drill 0.25, 0.35)
  Top 0.2: Z0.32 27.5,152.5 30.25,152.5 JP9.9 | v100.75,116.25 100.75,105 102.75,103 Z18.4 | v93.5,116.25 93.38,116.37 93.1,116.65 93.1,143.66 93.25,143.81 v93.25,146.75 | v86.75,150.5 86.75,163.75 84,163.75 Z3-4.24 | 14A.1 44.25,180.25 43,179 43,153.81 v43.07,153.74 | v66,156.5 66.75,157.25 66.75,161.5 v67.75,162.5
  Bottom 0.2: JP9.9 30.5,152.5 35.5,152.5 Z1-2.8 35.75,152.5 36.73,153.48 39.05,153.48 39.28,153.25 42.61,153.25 43.11,153.74 | v93.5,116.25 v100.75,116.25 | v93.25,146.75 90.25,149.75 Z15.6 90,150 87.25,150 v86.75,150.5 | v66,156.5 65.75,156.75 56.75,156.75 53.75,153.75 43.12,153.75 43.11,153.74 | v67.75,162.5 68,162.75 69.75,162.75 70.75,163.75 83.75,163.75 Z3-4.24 | 43.11,153.74 v43.07,153.74
A3  (via drill 0.25)
  Top 0.2: Z0.33 27.5,155 30.25,155 JP9.8 | v99.25,109 98.75,109.5 98.75,134.5 96,137.25 96,145.5 97.75,147.25 Z15.10 97.75,147.5 94.25,151 v94.25,153.75 | v96.25,164.5 96,164.25 96,154.25 v96.25,154 | v41,155.75 41.5,156.25 v41.5,171 | v85.25,152.25 85.5,152 85.5,150.25 v85.25,150 | v66,152.5 65.25,153.25 65.25,160 66.25,161 v66.25,163 | v60,168.75 v60,166.5
  Bottom 0.2: JP9.8 30.5,155 35.5,155 Z1-2.7 35.75,155 36.5,155.75 v41,155.75 | v99.25,109 100.25,108 102.75,108 Z18.2 | v96.25,164.5 85.75,164.5 84,166.25 Z3-4.25 | v96.25,154 96,153.75 v94.25,153.75 94,153.5 86.5,153.5 v85.25,152.25 | v41.5,171 42.25,171.75 42.5,171.75 43.25,172.5 43.25,174.5 45,174.5 | 45,174.5 49.25,174.5 50.25,175.5 52.5,175.5 54.5,177.5 54.5,180.25 18B.1 | v85.25,150 85,149.75 82.75,149.75 82.25,149.25 74.25,149.25 72.25,151.25 72.25,152.75 69.75,152.75 69.5,152.5 v66,152.5 | v66.25,163 62.75,166.5 v60,166.5 | v60,168.75 59.75,169 56,169 55.75,169.25 55.75,170.5 54.5,171.75 54,171.75 53.25,172.5 53.25,173.75 51.5,173.75 51,173.25 51,172.25 47.25,172.25 45,174.5
A4  (via drill 0.25)
  Top 0.2: Z0.34 27.5,157.5 30.25,157.5 JP9.7 | v95,152.5 95,165.5 94.75,165.75 94.75,167.75 v95,168 | v108.75,135 108.75,130 110.25,128.5 Z17.14 | v100.25,135 100,135.25 100,151.5 v100.25,151.75 | v48.25,161.5 48.5,161.75 48.5,172.5 | v48.5,175.75 48.5,172.5 | 48.5,172.5 51,172.5 51,173.25 52.75,175 v55.25,175 | v61,173.25 61.25,173 61.25,169.75 62.25,168.75 63.5,168.75 v63.5,167.5
  Bottom 0.2: JP9.7 30.5,157.5 35.5,157.5 Z1-2.6 35.75,157.5 44.5,157.5 45,158 45,159 44.5,159 44,159.5 44,161.5 v48.25,161.5 | v95,152.5 97.75,152.5 Z15.12 98,152.25 99.75,152.25 v100.25,151.75 | v95,168 84.75,168 84,168.75 Z3-4.26 83.75,168.75 80,165 66,165 v63.5,167.5 | v100.25,135 v108.75,135 | v48.5,175.75 48.75,176 50.5,176 52,177.5 52,180.25 17B.1 | v55.25,175 59.25,175 v61,173.25
A5  (via drill 0.25)
  Top 0.2: Z0.35 27.5,160 30.25,160 JP9.6 | v99.5,126.5 99.5,155.75 98,157.25 Z15.14 98,157.5 99.75,159.25 99.75,182.75 89.5,182.75 83,176.25 83,176 72.5,176 | v44,163.75 44.75,164.5 44.75,170.75 46.25,172.25 46.25,174 47.75,175.5 47.75,176 48.25,176.5 v48.25,179 | 72.5,176 70.75,176 68.75,174 Z3-4.1 | v37.5,156.75 37.5,158.25 35.75,160 Z1-2.5 | 72.5,176 v72.5,160.25
  Bottom 0.2: JP9.6 30.5,160 35.5,160 Z1-2.5 35.75,160 40.25,160 v44,163.75 | v99.5,126.5 99.75,126.75 104,126.75 104.25,126.5 107,126.5 110.25,123.25 Z17.12 | v48.25,179 49.5,180.25 16B.1 | v37.5,156.75 37.75,156.5 53,156.5 53.5,156 54,156 57.25,159.25 67,159.25 68,160.25 v72.5,160.25
A6  (via drill 0.25)
  Top 0.2: Z0.36 27.5,162.75 30.25,162.75 JP9.5 | v79.25,134.75 79,135 79,166 v74.25,170.75 | v105.25,114.75 103.5,113 v103.5,111.75 | v97,111.75 97,123.5 95.75,124.75 93.5,124.75 93.5,134 v93.75,134.25 | v43.75,165.25 44.25,165.75 44.25,171 45.75,172.5 v45.75,176 | v58.5,164.25 58.25,164.5 58.25,170.75 v58.5,171
  Bottom 0.2: JP9.5 30.5,162.75 35.5,162.75 Z1-2.4 36.25,163.25 41.75,163.25 v43.75,165.25 45.25,163.75 53.75,163.75 54,163.5 56,163.5 56.75,164.25 v58.5,164.25 | v79.25,134.75 86.25,134.75 87.5,133.5 Z16.2 87.75,133.5 93,133.5 v93.75,134.25 | v74.25,170.75 73.75,171.25 68.75,171.25 Z3-4.2 68.5,171.25 61.75,171.25 61.5,171 v58.5,171 | v105.25,114.75 107,114.75 110.25,118 Z17.10 | v97,111.75 v103.5,111.75 | v45.75,176 45.75,180.25 46.75,180.25 15B.1
A7  (via drill 0.25)
  Top 0.2: v90.25,120.5 90.25,125.75 87.75,128.25 Z16.4 | Z0.37 27.5,165.25 30.25,165.25 JP9.4 | v81.75,128.5 82,128.75 82,139.25 79.5,141.75 79.5,166.5 v77.25,168.75 | v59,167.75 59.25,168 v59.25,171.75 | v56.25,171.75 56,172 56,179 54.75,180.25 18A.1
  Bottom 0.2: v90.25,120.5 91.25,119.5 101.25,119.5 102.25,120.5 102.75,120.5 Z17.6 | JP9.4 30.5,165.25 35.5,165.25 Z1-2.3 35.75,165.25 36.5,166 46.25,166 46.5,165.75 49.25,165.75 50,166.5 57.75,166.5 v59,167.75 | v81.75,128.5 87.5,128.5 Z16.4 | Z3-4.3 68.75,168.75 v77.25,168.75 74.25,171.75 73.5,171.75 72.75,172.5 67.5,172.5 66.75,171.75 v59.25,171.75 v56.25,171.75
A8  (via drill 0.25)
  Top 0.2: Z0.38 27.5,167.75 30.25,167.75 JP9.3 | v45,106 46,107 46,129.75 44.75,131 44.75,151.25 45.5,152 47,152 47,159.5 46.75,159.75 v46.75,162.25 v46.75,166.5 46.75,172.25 v47.5,173 | v50.25,173.25 50.75,173.75 50.75,179 52,180.25 17A.1 | v78.75,128.5 78.25,129 v78.25,165.75 | v65.5,161.25 65.5,167 66.75,167 67.25,166.5 68.5,166.5 Z3-4.4
  Bottom 0.2: 78.75,125 78.75,124 79.25,123.5 87.25,123.5 87.5,123.25 Z16.6 | 78.75,125 86.25,125 86.5,124.75 102,124.75 102.75,125.5 Z17.4 | v45,106 38.25,106 33.25,101 D10.C | v46.75,162.25 47,162.5 50.75,162.5 Z1-2.25 51,162.5 52.75,160.75 65,160.75 v65.5,161.25 | v46.75,166.5 31.5,166.5 30.5,167.5 JP9.3 | v50.25,173.25 50,173 v47.5,173 | v78.75,128.5 78.75,125 | v78.25,165.75 77.75,166.25 68.75,166.25 Z3-4.4
A9  (via drill 0.25)
  Top 0.2: Z0.39 27.5,170.25 30.25,170.25 JP9.2 30.5,170 32.5,168 32.5,167.25 31.75,166.5 v25.75,166.5 | v99.5,121 100.25,121.75 v100.25,130.5 | v45,105 46.5,106.5 46.5,130.75 47.25,131.5 v47.25,135.25 47.25,151.5 47.5,151.75 47.5,156.75 50.75,160 Z1-2.24 | v6.5,163.75 1.25,158.5 1.25,139 5.5,134.75 5.5,133.75 7,132.25 7,131.5 7.5,131 16,131 v16,131.75 | v50,174.25 50,180 49.75,180.25 16A.1 | v57.75,174.25 57.75,164 58.25,163.5 v58.25,160 | v92,144.25 92,145 91,146 v89.25,146 | v86,149.25 86,161.25 84.5,162.75 81.5,162.75 v81.5,164.5 | Z16.10 95.25,120.5 93.5,118.75 93.5,117.25 96.25,114.5 96.25,110.5 96.75,110 98.25,110 98.25,132.5 96,134.75 94.25,134.75 94.25,134.87 93.63,135.49 93.63,143.62 v94.39,144.38
  Bottom 0.2: v99.5,121 95.5,121 95.25,120.75 Z16.10 | v100.25,130.5 100.5,130.75 102.75,130.75 Z17.2 | v45,105 39.75,105 35.75,101 D9.C | 58.25,160.25 51,160.25 Z1-2.24 | 58.25,160.25 66.25,160.25 66.25,162 67.5,163.25 68,163.25 Z3-4.5 69,164.25 81.25,164.25 v81.5,164.5 | v25.75,166.5 23,163.75 v6.5,163.75 | v16,131.75 17.75,133.5 34.5,133.5 36.5,135.5 42.25,135.5 42.5,135.25 v47.25,135.25 | v57.75,174.25 v50,174.25 | 58.25,160.25 v58.25,160 | v94.39,144.38 92.13,144.38 v92,144.25 | v86,149.25 v89.25,146
A10  (via drill 0.25)
  Top 0.2: Z0.40 27.5,172.75 30.25,172.75 JP9.1 | v46.5,175.25 46.75,175.5 46.75,180.25 15A.1 | v45,102.75 47,104.75 47,122.25 50,125.25 52.75,125.25 v52.75,128.5 52.75,130.75 49,134.5 49,135.25 48.5,135.75 48.5,150 50.75,152.25 Z1-2.21 | v34,171 33.75,170.75 33.75,157.25 35,156 37.5,156 v37.5,152.76
  Bottom 0.2: 40.75,173.5 41.25,173.5 43,175.25 v46.5,175.25 | 40.75,173.5 37.75,173.5 37.5,173.75 31.5,173.75 30.5,172.75 JP9.1 | v45,102.75 40,102.75 38.25,101 D8.C | v52.75,128.5 55.75,128.5 56,128.75 61.25,128.75 62,129.5 Z30.9 62.25,129.75 111.5,129.75 112.5,130.75 160.75,130.75 161.5,131.5 192,131.5 192,135.25 190.25,137 Z19.9 | 40.75,173.5 40.75,171.25 34.25,171.25 v34,171 | Z1-2.21 43.3,152.4 43.01,152.12 42.49,152.12 42.26,152.35 37.91,152.35 v37.5,152.76
A10'  (via drill 0.25)
  Top 0.2: v68.25,127 69,127.75 v69,131.5 | v76.25,134.75 76.75,135.25 v76.75,160.5
  Bottom 0.2: v68.25,127 Z30.8 | v69,131.5 72.25,134.75 v76.25,134.75 | v76.75,160.5 76,161.25 68.75,161.25 Z3-4.6
A11  (via drill 0.25)
  Top 0.2: JP2.1 9,172.75 12,172.75 Z0.1 12.25,172.5 15,172.5 v15,170.25 | v23.75,170.5 23.75,180 24,180.25 6A.1 | v45.5,168.75 45.5,158.25 v45.75,158 | v92,108.5 92,97 90.25,95.25 Z24.6 | v85.25,111 v86.75,109.5 | v81,111 79.75,112.25 79.75,118 79.25,118.5 v79.25,122.75 | v58.5,135.75 v58.5,128 58.5,122 58.25,121.75 58.25,117.25 58.5,117 58.5,103.5 v57.25,102.25 | v45,99.25 47,99.25 v47,101.75 | v48.25,135 48,135.25 48,154.5 50.75,157.25 Z1-2.23
  Bottom 0.2: v15,170.25 15.25,170.5 v23.75,170.5 25,169.25 26,169.25 26.5,168.75 v45.5,168.75 | v45.75,158 46.25,157.5 50.75,157.5 Z1-2.23 | v92,108.5 91,109.5 v86.75,109.5 | v85.25,111 85,110.75 81.25,110.75 v81,111 | v79.25,122.75 78.25,123.75 78.25,128 77.25,128 76,129.25 64,129.25 62.75,128 v58.5,128 | Z30.12 62,137 59.75,137 v58.5,135.75 53.5,135.75 53.25,135.5 48.75,135.5 v48.25,135 | v45,99.25 42.25,99.25 40.75,100.75 D7.C | v47,101.75 48,102.75 54.25,102.75 54.75,102.25 v57.25,102.25
A11'  (via drill 0.25)
  Top 0.2: v57.75,135 57.75,144.25 61,147.5 61,151.5 64,154.5 v64,158.5
  Bottom 0.2: v57.75,135 61.75,135 62,134.75 Z30.11 | v64,158.5 64.25,158.75 Z3-4.7
A12  (via drill 0.25)
  Top 0.2: 44.25,108.75 44.25,109 45.5,110.25 45.5,118.5 v45.25,118.75 | 44.25,108.75 44.25,102 43.25,101 D6.C | JP2.2 9,170.25 12,170.25 Z0.2 | 44.25,108.75 39.75,108.75 39.75,136 | 39.75,148 39.75,148.5 39.25,149 39.25,167 v39.5,167.25 | 39.75,148 39.75,136 | v25,173.5 25.25,173.75 25.25,175 26.5,176.25 26.5,180.25 7A.1 | v66.5,154 68.5,156 Z3-4.8 | v59,152.75 53.5,147.25 53.5,143.25 52.75,142.5 v52.75,137 | 39.75,136 v42.75,136 | v15,165.75 14.75,165.5 14.75,161.52 14.25,161.02 v14.25,159.27 | v34,155.75 33.75,155.5 33.75,149.5 34.75,148.5 37.5,148.5 v37.5,148 | 39.75,148 v39.5,148
  Bottom 0.2: v45.25,118.75 47.75,121.25 52,121.25 52.5,121.75 55.75,121.75 Z29.1 | v39.5,167.25 39.25,167.5 35.75,167.5 Z1-2.2 | 14,170.25 12.25,170.25 Z0.2 | 14,170.25 16.75,173 24.5,173 v25,173.5 | v66.5,154 63.5,154 62.25,152.75 v59,152.75 | v52.75,137 51.75,136 v42.75,136 | 14,170.25 14,165.75 v15,165.75 | v14.25,159.27 17.02,156.5 29,156.5 29.25,156.25 33.5,156.25 v34,155.75 | v39.5,148 v37.5,148
A13  (via drill 0.25, 0.35)
  Top 0.2: Z0.3 12,167.75 9,167.75 JP2.3 | v28.25,175.75 29,176.5 29,180.25 8A.1 | v58,101.5 59,102.5 v59,117.5 59.25,117.75 59.25,136 58.5,136.75 58.5,143.25 59.25,143.25 62.08,146.08 | v64,153.25 63.5,152.75 63.5,147.5 62.08,146.08 | v13.97,153.29 13.97,151.49 14.34,151.12 v14.47,151.12 | 62.08,146.08 v61.09,146.08 | v42.16,148.97 41.91,149.22 v41.91,150.93
  Bottom 0.2: v28.25,175.75 27.25,174.75 24.5,174.75 23.75,174 15.75,174 13.25,171.5 7,171.5 7,169.5 8.75,167.75 JP2.3 8.89,167.37 5.87,164.34 5.87,160.78 7.69,158.96 11.22,158.96 11.74,158.44 13.12,158.44 14.86,156.71 14.86,154.18 v13.97,153.29 | v58,101.5 55.25,101.5 53,99.25 47.25,99.25 45.75,100.75 D5.C | v59,117.5 57.25,119.25 56,119.25 Z29.2 | v64,153.25 68.25,153.25 68.5,153.5 Z3-4.9 | v61.09,146.08 60.69,146.08 60.41,146.35 55.08,146.35 54.6,146.83 54.6,147.84 53.54,148.9 49.74,148.9 49.67,148.97 v42.16,148.97 | v41.91,150.93 41.46,150.93 40.76,151.63 40.24,151.63 39.93,151.33 26.01,151.33 25.8,151.12 v14.47,151.12
A14  (via drill 0.25)
  Top 0.2: Z0.4 12,165.25 9,165.25 JP2.4 8.75,165 6.5,162.75 6.5,134.5 v6.75,134.25 | 60.5,138 60.5,133.75 62,132.25 Z30.10 62,132 60.5,130.5 60.5,125.25 60.75,125 v60.75,116.75 | 60.5,138 62,139.5 Z30.13 | D4.C 48.25,101 48,101.25 v48,113 47.75,113.25 v47.75,114.5 | 60.5,138 60.5,143 68.5,151 Z3-4.10 | v25.75,168.5 25.5,168.75 25.5,170.5 26.5,171.5 32.5,171.5 32.5,178.5 31.75,179.25 9A.1 | v44.75,116.25 44.5,116.5 v44.5,120 | v18,118.75 17.5,118.75 v16.75,119.5
  Bottom 0.2: v48,113 48.25,113.25 59.5,113.25 61.5,115.25 61.5,116.75 v60.75,116.75 56,116.75 Z29.3 | v25.75,168.5 22.75,168.5 19.25,165 12.25,165 Z0.4 | v47.75,114.5 46,116.25 v44.75,116.25 | v44.5,120 43.25,121.25 40.25,121.25 39.25,122.25 21.5,122.25 v18,118.75 | v16.75,119.5 15.5,118.25 8.5,118.25 6.5,120.25 6.5,134.25 v6.75,134.25
A15  (via drill 0.25)
  Top 0.2: v53.25,102 54.25,103 54.25,110.25 55.75,111.75 Z29.5 | JP2.5 9,162.75 12,162.75 Z0.5 12.25,162.75 13.75,164.25 v13.75,171 | v33.75,175 34.25,175.5 34.25,180.25 10A.1 | v50.75,97.75 50.75,100.75 D3.C | v33,97.75 31,99.75 31,103.75 25.25,109.5 25.25,116.75 22.25,119.75 22.25,157.75 23,158.5 v23,161.75
  Bottom 0.2: v53.25,102 52,102 51,101 D3.C | v13.75,171 16.25,173.5 24,173.5 24.75,174.25 28,174.25 28.75,175 v33.75,175 | v33,97.75 v50.75,97.75 | v23,161.75 22.25,162.5 12.25,162.5 Z0.5
ACE81_ENABLED  (via drill 0.25, 0.35)
  Top 0.2: R47.2 34.5,172.5 35.5,171.5 35.5,170.25 Z1-2.1 | v54.25,152.5 53.75,153 v53.75,156.75 | v48.75,159 47.5,160.25 v47.5,170.25 | v137.25,159.75 137.25,159 135.25,157 135.25,155.75 134.5,155 R42.2 | v160.25,162.75 163.25,159.75 163.25,154.75 v166,152 | v182.5,152 184.25,150.25 v184.25,129.25 | v199.75,127.25 199.75,101.25 203.25,97.75 203.25,95.75 201.75,94.25 v201.75,90.75 | v44.75,159.75 43.5,158.5 43.5,158 43.75,157.75 43.75,126.5 v40.5,123.25
  Top 0.4: v5.33,63.12 5.71,62.74 v147.57,62.74 | v11,86.75 11,105.04 11,112.75 v16.75,118.5
  Bottom 0.2: v54.25,152.5 58.25,152.5 62,148.75 JP13.1 | v53.75,156.75 51.5,159 v48.75,159 48,159.75 v44.75,159.75 | v47.5,170.25 35.75,170.25 Z1-2.1 | v137.25,159.75 137.75,160.25 140.75,160.25 142,161.5 149.25,161.5 150.25,162.5 160,162.5 v160.25,162.75 | v182.5,152 v166,152 | v184.25,129.25 185,128.5 193.5,128.5 195,127 199.5,127 v199.75,127.25 | v40.5,123.25 40,122.75 21,122.75 v16.75,118.5
  Bottom 0.4: v201.75,90.75 201.47,90.47 201.47,90.36 199.85,88.75 185.09,88.75 182.64,91.2 | R29.2 177.88,90.17 178.95,91.23 182.6,91.23 182.64,91.2 | 182.64,91.2 164.25,72.81 158.32,72.81 149.52,64.01 148.25,62.74 v147.57,62.74 | v5.33,63.12 5.33,81.08 v11,86.75
AMPLIF_IN
  Top 0.2: U2.3 194.5,179.25 180.25,179.25 180.25,177.5 179.5,176.75 176.75,176.75 176.75,180.25 R4.S
AMPLIF_OUT
  Top 0.2: U2.1 194.5,181.5 192.25,181.5 R34.2 192,181.75 189.25,181.75 R33.1
CLK  (via drill 0.25)
  Top 0.2: 166.25,96 166.25,96.5 R44.E | 166.25,96 166.25,92.75 167.5,91.5 C22.2 | R44.S 163.75,99 166,96.75 R44.E | 166.25,96 173.25,96 174.25,97 174.25,108 174.5,108.25 174.5,117.75 172.75,119.5 Z20.10 172.75,119.75 176.5,123.5 176.5,148.75 172,148.75 171,149.75 171,154.25 v169.25,156 | 166.25,96 R44.E
  Bottom 0.2: Z23.8 189,95.25 186.75,93 169.25,93 167.75,91.5 C22.2 | v169.25,156 145.25,156 145.25,154.5 146,153.75 151,153.75 Z9.1
CNT0  (via drill 0.25)
  Top 0.2: Z30.4 54.75,134.5 54.75,132.25 Z30.5 54.75,132 57,129.75 57,123 v57.75,122.25 | Z22.5 152.25,124.5 148.5,128.25 148.5,146 151,148.5 Z9.3 | v88.25,116.75 88.75,116.25 88.75,109.5 88,108.75 v88,97 | v94,97 96.75,94.25 106.25,94.25 v106.25,98 | v122.75,99 126,102.25 126,126.25 v125.75,126.5
  Bottom 0.2: v57.75,122.25 59.5,120.5 65.25,120.5 66.5,119.25 70.5,119.25 73,116.75 v88.25,116.75 | v88,97 88.25,96.75 93.75,96.75 v94,97 | v106.25,98 107.25,99 v122.75,99 | v125.75,126.5 126,126.75 141.5,126.75 143.75,124.5 152.25,124.5 Z22.5
CNT1
  Top 0.2: Z22.4 152.25,127 149,130.25 149,144 151,146 Z9.4
CNT2  (via drill 0.25)
  Top 0.2: Z22.3 152.25,129.75 149.5,132.5 149.5,142 151,143.5 Z9.5 | v178.25,149 178.25,160 182.75,160 Z41.5
  Bottom 0.2: v178.25,149 175.5,146.25 161,146.25 159.25,144.5 152,144.5 151.25,143.75 Z9.5
CNT3  (via drill 0.25)
  Top 0.2: v147,142 146.5,142.5 146.5,152.25 JP5.1
  Bottom 0.2: v147,142 150,142 151,141 Z9.6 | Z9.13 158.75,151.25 157.75,152.25 146.5,152.25 JP5.1
CNT3'
  Top 0.2: R11.1 142,152.5 143.75,152.5 JP5.2
CNT4
  Top 0.2: Z10.1 150.75,173.5 148,170.75 148,159 146.5,157.5 JP10.1
  Bottom 0.2: Z9.11 158.75,146.25 157.5,147.5 145.25,147.5 137.75,155 137.75,157.5 140.25,157.5 141.5,156.25 144.75,156.25 145.75,157.25 146.25,157.25 JP10.1
CNT4'
  Top 0.2: R12.1 142,157.5 143.75,157.5 JP10.2
CNT5  (via drill 0.25)
  Top 0.2: Z10.3 150.75,168.5 148.5,168.5 148.5,158 146.75,156.25 145.25,156.25 145.25,159 146.25,160 JP10.3 | v184.5,103.75 185,104.25 185,165.5 183,167.5 Z41.2
  Bottom 0.2: v184.5,103.75 182.75,102 176.75,102 Z25.11 | Z21.11 203,153.75 201.5,155.25 201.5,157.75 204.25,157.75 205,158.5 205,164 186.5,164 183,167.5 Z41.2 182.75,167.75 181.75,168.75 164.5,168.75 163.5,169.75 152,169.75 151,168.75 Z10.3
CNT5'
  Top 0.2: R13.1 142,160 143.75,160 JP10.4
CNT6
  Top 0.2: Z22.1 152.5,134.75 153.5,135.75 153.5,140.25 154,140.75 154,163 151,166 Z10.4
  Bottom 0.2: JP10.5 146.25,162.75 145,164 145,166.25 150.75,166.25 Z10.4
CNT6'
  Top 0.2: R14.1 142,162.75 143.75,162.75 JP10.6
CNT7  (via drill 0.25)
  Top 0.2: v198.25,107 199,107.75 199,131.5 205.5,138 205.5,158.5 204.25,159.75 201.5,159.75 | 201.5,159.75 201.5,152.75 203,151.25 Z21.10 | v201,162.5 201.5,162 201.5,159.75
  Bottom 0.2: JP10.7 146.5,165 149.5,165 150.75,163.75 Z10.5 151,163.75 151.75,164.5 161,164.5 164,161.5 193.75,161.5 194.75,162.5 v201,162.5 | v198.25,107 188.5,107 186,104.5 177,104.5 176.75,104.75 Z25.12
CNT7'
  Top 0.2: R15.1 142,165.25 143.75,165.25 JP10.8
CNT8  (via drill 0.25)
  Top 0.2: Z25.2 168.75,107.25 167.25,105.75 167.25,105.25 166.75,104.75 162.25,104.75 162.25,130 160.25,132 Z22.13 160.25,132.25 161.75,133.75 161.75,136.75 160.5,138 160.5,161 159,162.5 156.75,162.5 156.75,167.5 | v197.75,168 200.25,165.5 200.25,151.5 203,148.75 Z21.9 | 156.75,167.5 150,167.5 149,166.5 149,162.75 150.75,161 Z10.6 | 156.75,167.5 156.75,169.5 158.25,171 Z10.13
  Bottom 0.2: v197.75,168 194.5,171.25 158.5,171.25 Z10.13
CNT9  (via drill 0.25)
  Top 0.2: v156,165.25 155.25,164.5 v155.25,146.75 | v145.75,146.5 145,145.75 145,121 147,119 147,116.01 148.01,115 148.01,113.37 146.26,111.62 146.12,111.76 JP18.2
  Bottom 0.2: R21.1 143.5,111.75 145.5,111.75 145.51,111.76 JP18.2 | v156,165.25 157.5,165.25 158.25,166 Z10.11 | v155.25,146.75 153.5,145 147.25,145 v145.75,146.5
CNT10  (via drill 0.25)
  Top 0.2: v154.5,163.5 154.5,124.75 155.25,124 155.25,117.73 v153.75,116.23
  Bottom 0.2: R22.1 142.25,115.5 143.25,114.5 145.85,114.5 | v154.5,163.5 158.25,163.5 Z10.10 | v153.75,116.23 152.02,114.5 145.85,114.5 | JP18.1 145.85,114.5
CNT11  (via drill 0.25)
  Top 0.2: v162,157.25 162,153.25 165,150.25 Z11.1 | v156.5,118.25 156.5,137.5 156.25,137.75 156.25,158.75 158.25,160.75 Z10.9
  Bottom 0.2: v162,157.25 158.5,160.75 Z10.9 | v156.5,118.25 148.25,118.25 JP17.2
CNT12  (via drill 0.25)
  Top 0.2: v162.25,152 162.25,149 | 162.25,149 162.25,148 165,145.25 Z11.3 | v165.5,176.5 165.5,172 167.75,169.75 167.75,150.75 166,149 162.25,149
  Bottom 0.2: v162.25,152 164,153.75 169.5,153.75 172.25,156.5 174.5,156.5 176.5,158.5 187.25,158.5 189.5,156.25 195.5,156.25 Z21.3 | v165.5,176.5 151.5,176.5 148,173 132.75,173 130.75,171 120.75,171 118.75,169 114.25,169 112,171.25 103.75,171.25 102.75,170.25 JP15.1
CNT12'
  Top 0.2: R16.1 106.75,170.25 105.25,170.25 JP15.2
CNT13  (via drill 0.25)
  Top 0.2: v112.25,166.5 113,165.75 v113,156 | v136,156 138.5,153.5 v138.5,148.75
  Bottom 0.2: Z21.4 195.5,153.5 193.75,153.5 193.75,151.25 191.25,148.75 189.5,148.75 184.5,143.75 166.25,143.75 165.25,142.75 Z11.4 165,142.5 150,142.5 149.75,142.75 144.5,142.75 v138.5,148.75 | v112.25,166.5 103.75,166.5 102.75,167.5 JP15.3 | v136,156 v113,156
CNT13'
  Top 0.2: R17.1 106.75,167.75 105.25,167.75 JP15.4
CNT14  (via drill 0.25)
  Top 0.2: v110.75,163.75 111,163.5 v111,160.75 | v140,146.25 v140,161
  Bottom 0.2: Z21.5 195.5,151 195,150.5 193.75,150.5 193.75,148.75 191.25,146.25 189.5,146.25 184.5,141.25 166.25,141.25 165.25,140.25 Z11.5 165,140 146.25,140 v140,146.25 | v110.75,163.75 105,163.75 104.25,164.5 103.25,164.5 102.75,165 JP15.5 | v111,160.75 111.25,161 v140,161
CNT14'
  Top 0.2: R18.1 106.75,165.25 105.25,165.25 JP15.6
CNT15  (via drill 0.25)
  Top 0.2: v169.25,138.25 171,140 171,146 172.5,147.5 Z11.13 | v192.5,154.75 192.5,158.25 195.5,161.25 Z21.1 | v136.25,161.75 138.5,159.5 v138.5,156.75
  Bottom 0.2: v169.25,138.25 166,138.25 165.25,137.5 Z11.6 | 173.75,148.75 172.75,147.75 Z11.13 | 173.75,148.75 174.75,149.75 182.5,149.75 Z19.1 182.75,150 187.75,150 v192.5,154.75 | v136.25,161.75 136,161.5 103.75,161.5 102.75,162.5 JP15.7 | v138.5,156.75 141.75,153.5 144.25,153.5 145.25,152.5 145.25,149.75 163.5,149.75 164.5,148.75 173.75,148.75
CNT15'
  Top 0.2: R19.1 106.75,162.75 105.25,162.75 JP15.8
CNT16  (via drill 0.25)
  Top 0.2: 180.75,145.5 182.5,147.25 Z19.2 | 180.75,145.5 v178.25,143 | v180,159.25 180.75,158.5 180.75,145.5 | v107,154.25 107,158.75 104,158.75 102.75,160 JP15.9 | v129.75,153.75 130.25,154.25 v130.25,158.25
  Bottom 0.2: v178.25,143 173,143 172.75,142.75 Z11.11 | 181.75,161 193.25,161 195.5,158.75 Z21.2 | v180,159.25 181.75,161 | v107,154.25 107.5,153.75 v129.75,153.75 | v130.25,158.25 131,159 149.25,159 150.25,160 155.25,160 157.25,162 162.75,162 163.75,161 181.75,161
CNT16'
  Top 0.2: R20.1 106.75,160 105.25,160 JP15.10
CNT17  (via drill 0.25)
  Top 0.2: v166.5,105.5 162.75,109.25 162.75,125 165,127.25 Z20.2 | v169.25,130.25 169.25,136.75 172.5,140 Z11.10
  Bottom 0.2: v166.5,105.5 168.25,105.5 168.75,105 Z25.3 | v169.25,130.25 166.5,127.5 165.25,127.5 Z20.2
D0  (via drill 0.25)
  Top 0.2: v109.25,144 107.5,142.25 107.5,122.25 107,121.75 107,117 | v107,104.5 107,117 | JP2.14 9,139.75 12,139.75 Z0.14 12.25,139.75 14.25,139.75 14.75,140.25 14.75,143.25 v15,143.5 | v106.25,117 107,117 | v72.75,119.25 72.75,127.25 71,129 v71,134.5 71.25,134.75 71.25,146 71,146.25 v71,148 70.75,148.25 70.75,159.5 72,160.75 72,174.5 71,174.5 70.5,174 70.5,173 67.25,173 v66.25,174 | v49.25,146.5 49,146.25 49,136 52.75,132.25 v52.75,131.75
  Bottom 0.2: v109.25,144 111,144 111.75,144.75 R100.1 | v107,104.5 107.5,104 111.5,104 112.5,103 116.75,103 R200.1 | v15,143.5 34.25,143.5 35.5,144.75 Z1-2.11 35.75,145 36.25,145.5 39.25,145.5 40.25,146.5 v49.25,146.5 | v71,134.5 Z14.3 66.75,130.25 63.75,130.25 63.25,130.75 53.75,130.75 v52.75,131.75 | v71,148 70.5,148.5 68.75,148.5 Z3-4.11 | v106.25,117 91.5,117 89.25,119.25 v72.75,119.25 | v66.25,174 64.75,174 63.25,175.5 61.75,175.5 61,176.25 59.75,176.25 59.75,180.25 20B.1
D1  (via drill 0.25)
  Top 0.2: Z0.15 12,137.25 9,137.25 JP2.15 | v64.75,126.25 v64.75,141.25 64.75,143 67.75,146 68.5,146 Z3-4.12 | v105.5,104.25 105.5,114 106,114.5 106,116.25 105.5,116.75 105.5,120.25 106,120.75 106,127.25 106.5,127.75 106.5,142 v106.25,142.25 | v58.75,174.25 58.75,179.5 59.5,180.25 20A.1 | v66.5,166.25 67.75,165 70.25,165 v70.25,162.25 | v76.75,161.75 77.5,161 v77.5,156.5 | v73.75,155.75 72.25,154.25 v72.25,149.75 | v86.75,141.75 85.5,143 85.5,146.5 84.5,147.5 82,147.5 v82,147.75